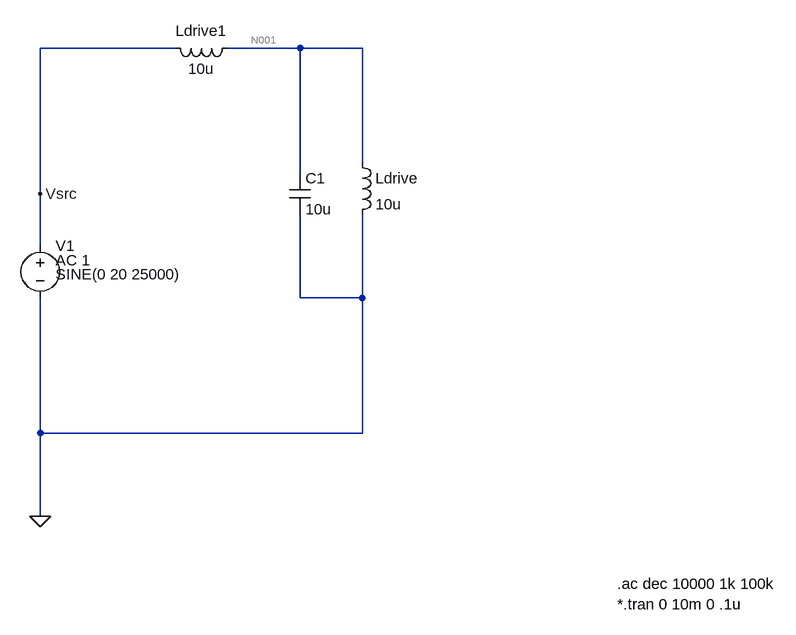
[diagram p0: schematic ESR_Test.asc]
ESR_Test.asc, the LTspice schematic file:
Version 4
SHEET 1 2128 1188
WIRE 32 64 -176 64
WIRE 224 64 112 64
WIRE 320 64 224 64
WIRE 320 240 320 64
WIRE 224 256 224 64
WIRE -176 288 -176 64
WIRE -176 368 -176 288
WIRE 224 448 224 320
WIRE 320 448 320 320
WIRE 320 448 224 448
WIRE -176 656 -176 448
WIRE 320 656 320 448
WIRE 320 656 -176 656
WIRE -176 784 -176 656
FLAG -176 288 Vsrc
FLAG -176 784 0
SYMBOL voltage -176 352 R0
WINDOW 123 24 38 Left 2
WINDOW 3 24 60 Left 2
WINDOW 39 0 0 Left 0
SYMATTR Value2 AC 1
SYMATTR Value SINE(0 20 25000)
SYMATTR InstName V1
SYMBOL ind 304 224 R0
SYMATTR InstName Ldrive
SYMATTR Value 10u
SYMATTR SpiceLine Rser=50m
SYMBOL ind 128 48 R90
WINDOW 0 5 56 VBottom 2
WINDOW 3 32 56 VTop 2
SYMATTR InstName Ldrive1
SYMATTR Value 10u
SYMATTR SpiceLine Rser=1
SYMBOL cap 208 256 R0
SYMATTR InstName C1
SYMATTR Value 10u
SYMATTR SpiceLine Rser=50m
TEXT 712 888 Left 2 !.ac dec 10000 1k 100k\n*.tran 0 10m 0 .1u

The netlist it stands for:
* ESR_Test.asc
V1 Vsrc 0 SINE(0 20 25000) AC 1
Ldrive N001 0 10u Rser=50m
Ldrive1 N001 Vsrc 10u Rser=1
C1 N001 0 10u Rser=50m
.ac dec 10000 1k 100k
*.tran 0 10m 0 .1u
.backanno
.end

* Results of the author's LTspice run, read from the files saved beside the schematic
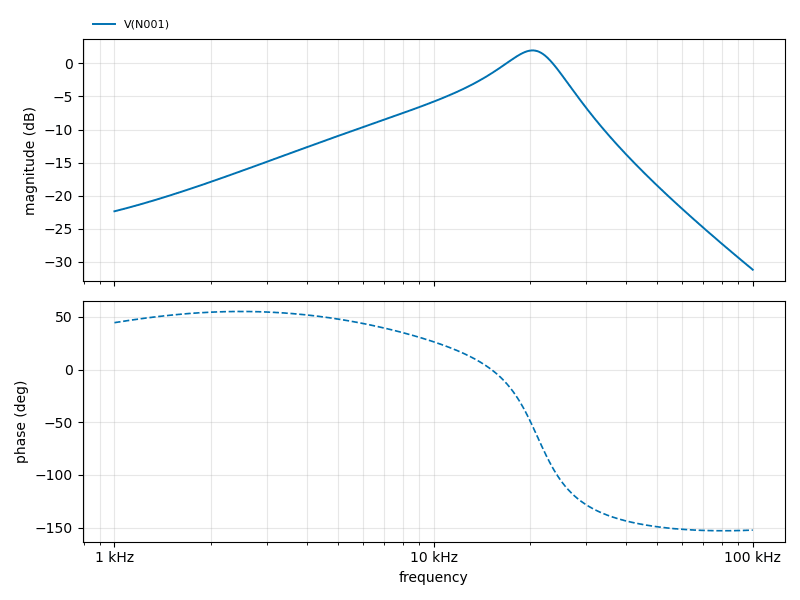
[diagram p1: AC Analysis of ESR_Test.asc, plotted from the saved traces]
* AC Analysis, 1 run:
*   V(N001): -22.36 dB at 1 kHz, -31.19 dB at 100 kHz, peak 1.96 dB at 20.42 kHz, 3 dB below the peak at 15.7 kHz and 24.58 kHz